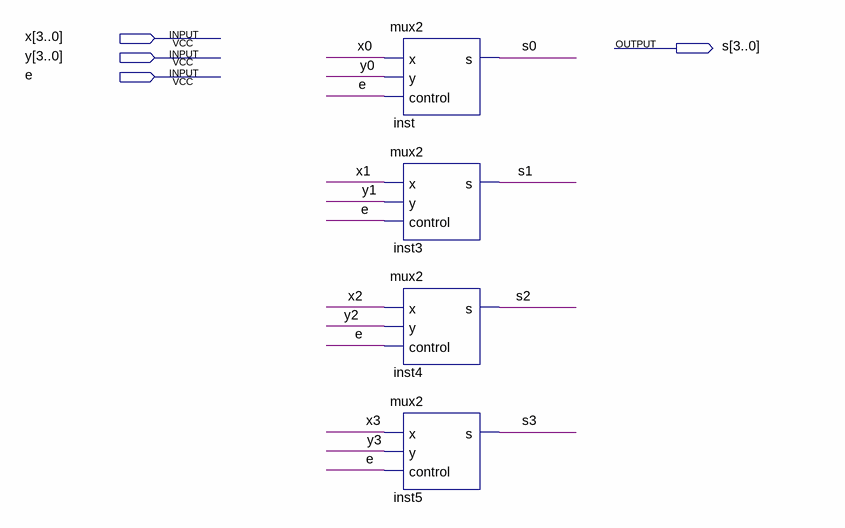
[diagram p0: schematic sheet]
// Quartus schematic muxVetor2.bdf as structural Verilog: 4 symbols, 4 pins
module muxVetor2 (
  input  [3:0] x,
  input  [3:0] y,
  input  e,
  output [3:0] s
);

  mux2 inst (.x(x[0]), .y(y[0]), .control(e), .s(s[0]));
  mux2 inst3 (.x(x[1]), .y(y[1]), .control(e), .s(s[1]));
  mux2 inst4 (.x(x[2]), .y(y[2]), .control(e), .s(s[2]));
  mux2 inst5 (.x(x[3]), .y(y[3]), .control(e), .s(s[3]));
endmodule
